# Altium schematic sheet Interface.SchDoc
size A4
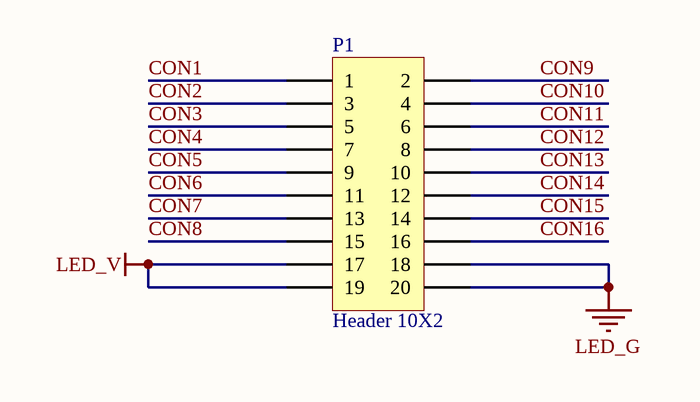
[diagram p0: Interface.SchDoc]

## Parts
P1  Header 10X2  [HDR2.54-LI-2x10P]

## Nets
LED_G: P1.18 P1.20
LED_V: P1.17 P1.19
CON1: P1.1
CON2: P1.3
CON3: P1.5
CON4: P1.7
CON5: P1.9
CON6: P1.11
CON7: P1.13
CON8: P1.15
CON9: P1.2
CON10: P1.4
CON11: P1.6
CON12: P1.8
CON13: P1.10
CON14: P1.12
CON15: P1.14
CON16: P1.16

## Library data of the parts
P1 = Header 10X2: Header, 10-Pin, Dual row; LatestRevisionDate: 17-Jul-2002; LatestRevisionNote: Re-released for DXP Platform.; Publisher: Altium Limited